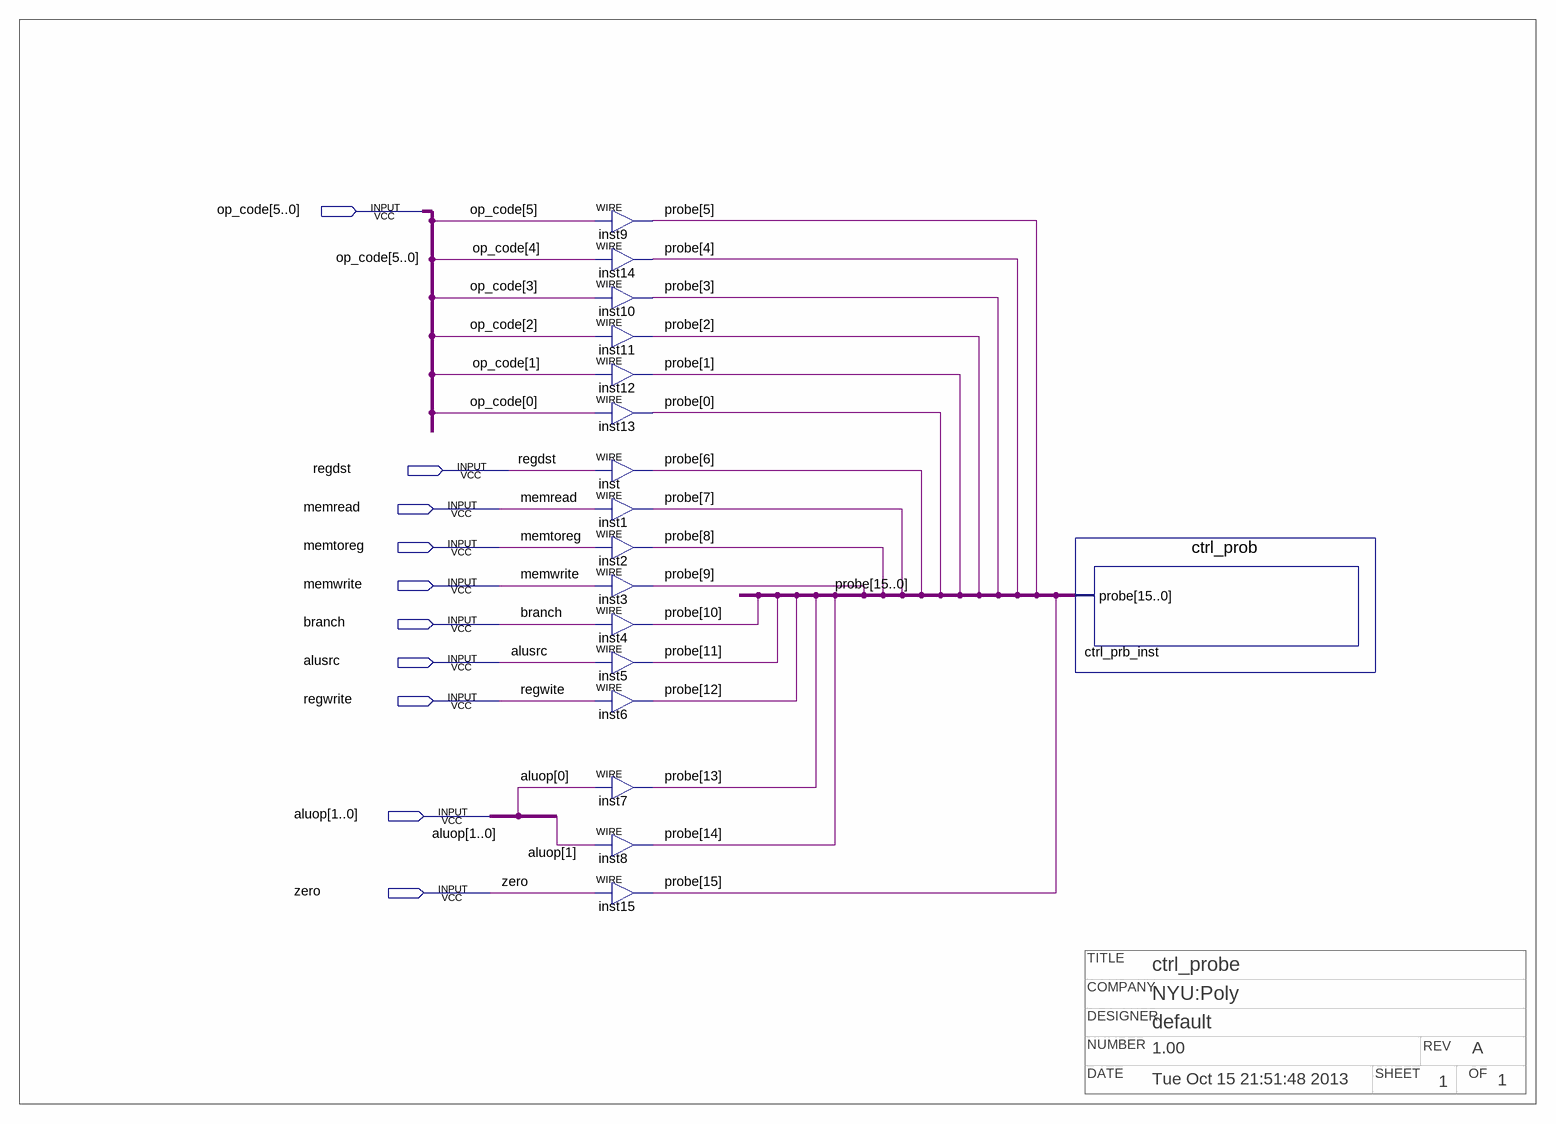
[diagram p0: schematic sheet]
// Quartus schematic ctrl_prb.bdf as structural Verilog: 17 symbols, 10 pins
// Title block: COMPANY: NYU:Poly; DATE: Tue Oct 15 21:51:48 2013; DESIGNER: default; NUMBER: 1.00; OF: 1; REV: A; SHEET: 1; TITLE: ctrl_probe
module ctrl_prb (
  input  [5:0] op_code,
  input  regdst,
  input  memread,
  input  memtoreg,
  input  memwrite,
  input  branch,
  input  alusrc,
  input  regwrite,
  input  [1:0] aluop,
  input  zero
);

  wire [15:0] probe;

  assign probe[5] = op_code[5];  // WIRE inst9
  assign probe[4] = op_code[4];  // WIRE inst14
  assign probe[3] = op_code[3];  // WIRE inst10
  assign probe[2] = op_code[2];  // WIRE inst11
  assign probe[1] = op_code[1];  // WIRE inst12
  assign probe[0] = op_code[0];  // WIRE inst13
  assign probe[6] = regdst;  // WIRE inst
  assign probe[7] = memread;  // WIRE inst1
  assign probe[8] = memtoreg;  // WIRE inst2
  assign probe[9] = memwrite;  // WIRE inst3
  assign probe[10] = branch;  // WIRE inst4
  assign probe[11] = alusrc;  // WIRE inst5
  assign probe[12] = regwrite;  // WIRE inst6
  assign probe[13] = aluop[0];  // WIRE inst7
  assign probe[14] = aluop[1];  // WIRE inst8
  assign probe[15] = zero;  // WIRE inst15
  ctrl_prob ctrl_prb_inst (.probe(probe));

  // Other names for the same wires on the sheet: regwite = regwrite
endmodule
